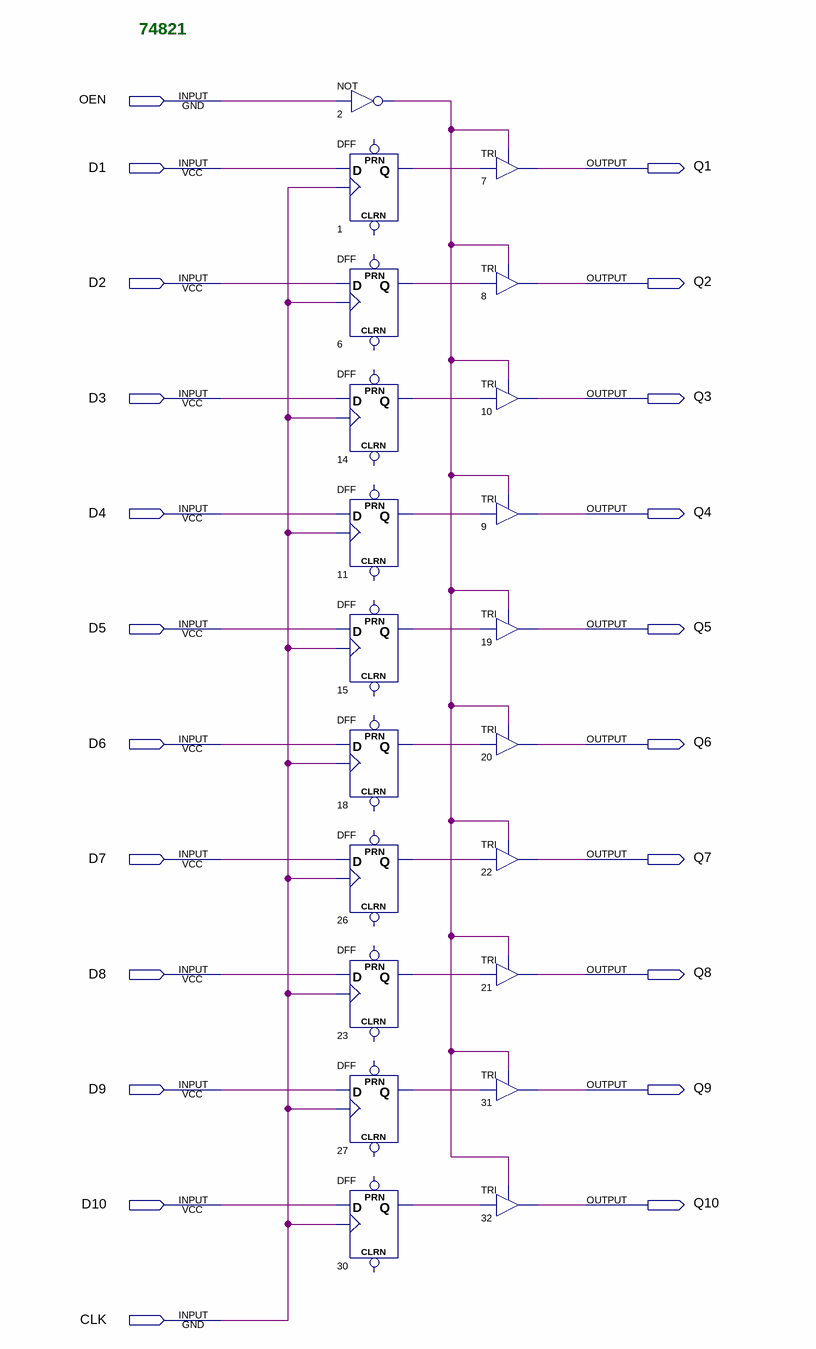
[diagram p0: schematic sheet]
// Quartus schematic 74821.bdf as structural Verilog: 21 symbols, 22 pins
module \74821  (
  input  OEN,
  input  D1,
  input  D2,
  input  D3,
  input  D4,
  input  D5,
  input  D6,
  input  D7,
  input  D8,
  input  D9,
  input  D10,
  input  CLK,
  output Q1,
  output Q2,
  output Q3,
  output Q4,
  output Q5,
  output Q6,
  output Q7,
  output Q8,
  output Q9,
  output Q10
);

  wire n1_q, n2_out, n6_q, n11_q, n14_q, n15_q, n18_q, n23_q, n26_q, n27_q, n30_q;

  not u_2 (n2_out, OEN);
  DFF u_1 (.CLK(CLK), .D(D1), .Q(n1_q));  // open: CLRN, PRN
  DFF u_6 (.CLK(CLK), .D(D2), .Q(n6_q));  // open: CLRN, PRN
  DFF u_14 (.CLK(CLK), .D(D3), .Q(n14_q));  // open: CLRN, PRN
  DFF u_11 (.CLK(CLK), .D(D4), .Q(n11_q));  // open: CLRN, PRN
  DFF u_15 (.CLK(CLK), .D(D5), .Q(n15_q));  // open: CLRN, PRN
  DFF u_18 (.CLK(CLK), .D(D6), .Q(n18_q));  // open: CLRN, PRN
  DFF u_26 (.CLK(CLK), .D(D7), .Q(n26_q));  // open: CLRN, PRN
  DFF u_23 (.CLK(CLK), .D(D8), .Q(n23_q));  // open: CLRN, PRN
  DFF u_27 (.CLK(CLK), .D(D9), .Q(n27_q));  // open: CLRN, PRN
  DFF u_30 (.CLK(CLK), .D(D10), .Q(n30_q));  // open: CLRN, PRN
  TRI u_7 (.IN(n1_q), .OE(n2_out), .OUT(Q1));
  TRI u_8 (.IN(n6_q), .OE(n2_out), .OUT(Q2));
  TRI u_10 (.IN(n14_q), .OE(n2_out), .OUT(Q3));
  TRI u_9 (.IN(n11_q), .OE(n2_out), .OUT(Q4));
  TRI u_19 (.IN(n15_q), .OE(n2_out), .OUT(Q5));
  TRI u_20 (.IN(n18_q), .OE(n2_out), .OUT(Q6));
  TRI u_22 (.IN(n26_q), .OE(n2_out), .OUT(Q7));
  TRI u_21 (.IN(n23_q), .OE(n2_out), .OUT(Q8));
  TRI u_31 (.IN(n27_q), .OE(n2_out), .OUT(Q9));
  TRI u_32 (.IN(n30_q), .OE(n2_out), .OUT(Q10));

  // Notes on the sheet:
  //   74821
endmodule
